# EAGLE design haasoscope_trigger_board_v1.1 (EAGLE 9.6.2)
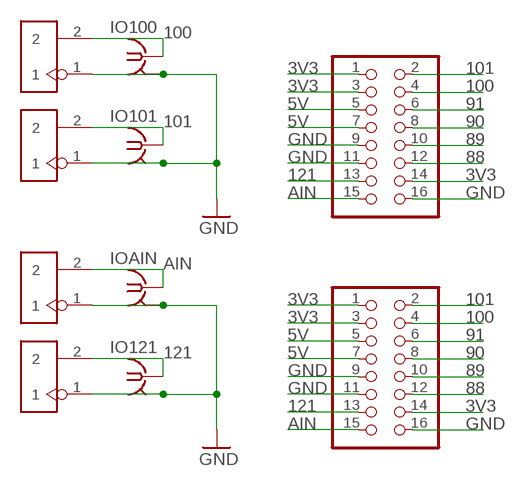
[diagram p0: schematic, sheet 1]

## Parts
IO100  BU-SMB-V  [BU-SMB-V]
IO101  BU-SMB-V  [BU-SMB-V]
IO121  BU-SMB-V  [BU-SMB-V]
IOAIN  BU-SMB-V  [BU-SMB-V]
J1  2p-2.54  DIP-BLACK-MALE-HEADER-VERT(2P-2.54)  [H2-2.54]
J2  2p-2.54  DIP-BLACK-MALE-HEADER-VERT(2P-2.54)  [H2-2.54]
J3  2p-2.54  DIP-BLACK-MALE-HEADER-VERT(2P-2.54)  [H2-2.54]
J4  2p-2.54  DIP-BLACK-MALE-HEADER-VERT(2P-2.54)  [H2-2.54]
JP1  Jp1  PINHD-2X8  [2X08]
JP2  JP2  PINHD-2X8  [2X08]

## Nets
3V3: JP1.1 JP1.3 JP1.14 JP2.1 JP2.3 JP2.14
5V: JP1.5 JP1.7 JP2.5 JP2.7
88: JP1.12 JP2.12
89: JP1.10 JP2.10
90: JP1.8 JP2.8
91: JP1.6 JP2.6
100: IO100.1 J1.2 JP1.4 JP2.4
101: IO101.1 J2.2 JP1.2 JP2.2
121: IO121.1 J4.2 JP1.13 JP2.13
AIN: IOAIN.1 J3.2 JP1.15 JP2.15
GND: IO100.2 IO100.3 IO100.4 IO100.5 IO101.2 IO101.3 IO101.4 IO101.5 IO121.2 IO121.3 IO121.4 IO121.5 IOAIN.2 IOAIN.3 IOAIN.4 IOAIN.5 J1.1 J2.1 J3.1 J4.1 JP1.9 JP1.11 JP1.16 JP2.9 JP2.11 JP2.16

## Library data of the parts
IO100 IO101 IO121 IOAIN = con-coax:BU-SMB-V: FEMALE SMB CONNECTOR Radiall distributor RS 112-2993; OC_FARNELL: unknown; OC_NEWARK: unknown
J1-J4 = Seeed-Connector:DIP-BLACK-MALE-HEADER-VERT(2P-2.54): 320020016; MPN: P125-1102A0BS116A1
JP1 JP2 = pinhead:PINHD-2X8: PIN HEADER

## Net classes
0 default: width 0.508 mm

## Board
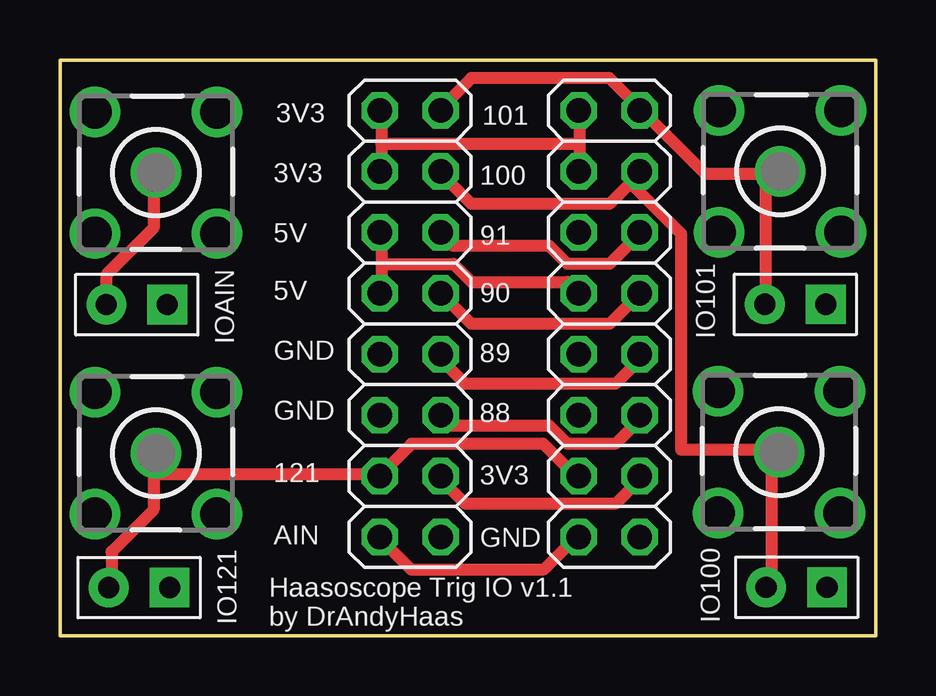
[diagram p1: board, top side]
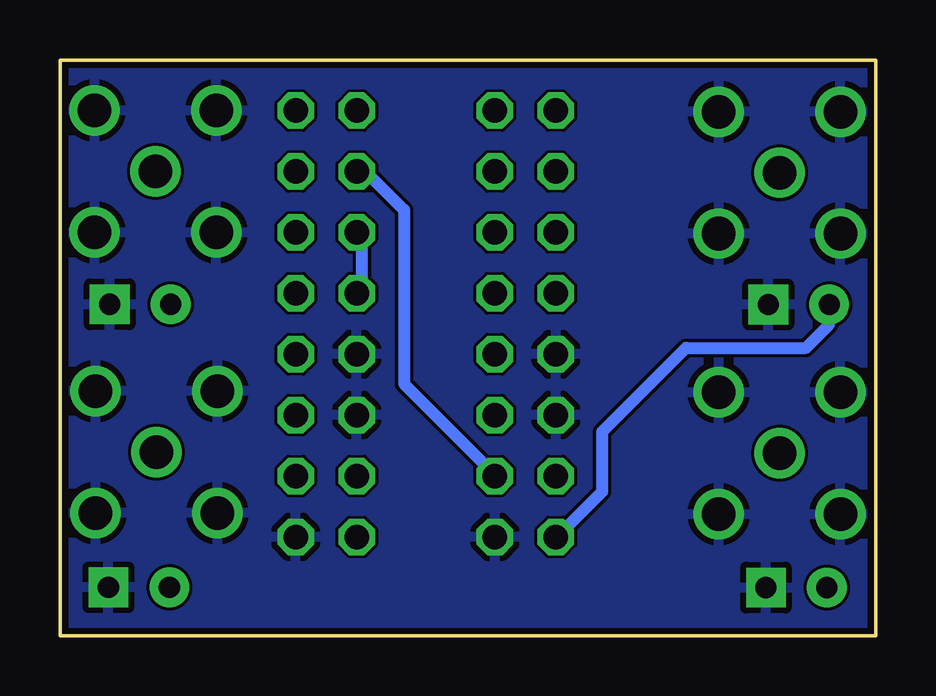
[diagram p2: board, bottom side, seen from below]

Size 34 x 24 mm. Coordinates in mm from the lower left corner, seen from the top.
Outline: 0,0 0,24 34,24 34,0 0,0
Copper layers (1*16): Top 0.035mm / dielectric 1.5mm / Bottom 0.035mm
Design rules "MF_Standard_2_Layer": minimum track width 5mil, minimum drill 12mil, track to track 5mil, track to pad 5mil, pad to pad 5mil, via to via 5mil, smd to smd 0mil, copper to edge 10mil, drill to drill 10mil, minimum pad ring 6mil, minimum via ring 6mil, stop-mask expansion 2mil, vias tented up to drill 25mil, thermal gap 10mil

### Footprints (pad centres in the part's own frame; a part is rotated, then mirrored left to right if it is on the bottom)
BU-SMB-V = drill 1.4: 1 0,0; 2 -2.54,2.54; 3 2.54,2.54; 4 2.54,-2.54; 5 -2.54,-2.54
H2-2.54 = drill 0.889 pad 1.651 square: 1 0,1.27 | drill 0.889 pad 1.651: 2 0,-1.27
2X08 = drill 1.016 octagon: 1 -8.89,-1.27; 2 -8.89,1.27; 3 -6.35,-1.27; 4 -6.35,1.27; 5 -3.81,-1.27; 6 -3.81,1.27; 7 -1.27,-1.27; 8 -1.27,1.27; 9 1.27,-1.27; 10 1.27,1.27; 11 3.81,-1.27; 12 3.81,1.27; 13 6.35,-1.27; 14 6.35,1.27; 15 8.89,-1.27; 16 8.89,1.27

### Placement (x,y rotation side)
IO100  29.97,7.65 0 top
IO101  30.02,19.35 0 top
IO121  4,7.6 0 top
IOAIN  4,19.3 0 top
J1  30.71,2.01 270 top
J2  30.66,13.81 270 top
J3  3.2,13.8 270 top
J4  3.3,2 270 top
JP1  22.9,13 270 top
JP2  14.6,13 270 top

### Tracks (layer width: path | path; a pad name or v marks a point on that pad's centre or on a via)
3V3
  Top 0.508: JP2.14 15.9,6.5 16.9,5.5 23.15,5.5 24.15,6.5 JP1.14 | 13.4,20.5 13.4,21.75 JP2.1 | 13.4,20.5 13.4,19.5 JP2.3 | 21.65,20.5 21.65,21.75 JP1.1 | 21.65,20.5 21.65,19.5 JP1.3 | 21.65,20.5 13.4,20.5
  Bottom 0.508: JP2.14 15.9,6.75 19.65,10.5 19.65,17.75 21.4,19.5 JP1.3
5V
  Top 0.508: 13.4,15.5 13.4,16.75 JP2.5 | 13.4,15.5 13.4,14.5 JP2.7 | JP1.7 21.15,14.75 17.15,14.75 16.4,15.5 13.4,15.5
  Bottom 0.508: JP1.5 21.4,16.75 21.4,14.5 JP1.7
88
  Top 0.508: JP2.12 15.9,9 16.15,8.75 20.4,8.75 21.15,8 23.15,8 24.15,9 JP1.12
89
  Top 0.508: JP2.10 15.9,11.5 16.9,10.5 23.15,10.5 24.15,11.5 JP1.10
90
  Top 0.508: JP1.8 22.9,13 17.15,13 15.9,14.25 JP2.8
91
  Top 0.508: JP2.6 15.9,16.75 16.4,16.25 20.4,16.25 21.15,15.5 22.9,15.5 24.15,16.75 JP1.6
100
  Top 0.508: JP2.4 15.9,19.25 17.15,18 22.9,18 24.15,19.25 JP1.4 23.9,18.75 25.9,16.75 25.9,7.75 29.65,7.75 IO100.1 29.9,7.5 29.65,7.5 29.65,2.25 J1.2
101
  Top 0.508: JP2.2 15.9,22 17.15,23.25 22.9,23.25 24.15,22 JP1.2 24.4,21.75 26.9,19.25 29.15,19.25 IO101.1 29.9,19.25 29.4,19.25 29.4,14 J2.2
121
  Top 0.508: JP1.13 21.4,6.75 20.15,8 14.65,8 13.4,6.75 JP2.13 13.15,6.75 4.15,6.75 IO121.1 3.9,7.5 3.9,5.25 2.15,3.5 2.15,2 J4.2
AIN
  Top 0.508: JP2.15 13.4,4 14.65,2.75 20.15,2.75 21.4,4 JP1.15 | IOAIN.1 3.9,19.25 3.9,17 1.93,15.03 J3.2
  Bottom 0.508: JP2.15 13.15,4.25 11.4,6 11.4,8.5 7.9,12 2.9,12 1.93,12.97 J3.2
GND
  pour Bottom: -2.1,25 35.9,25 35.9,-1 -2.1,-1

### Text on the board
tPlace: 3V3 | 101 | 3V3 | 100 | 5V | 91 | 5V | 90 | GND | 89 | GND | 88 | 121 | 3V3 | AIN | GND | Haasoscope Trig IO v1.1 / by DrAndyHaas